# EAGLE design elpc (EAGLE 4.16)
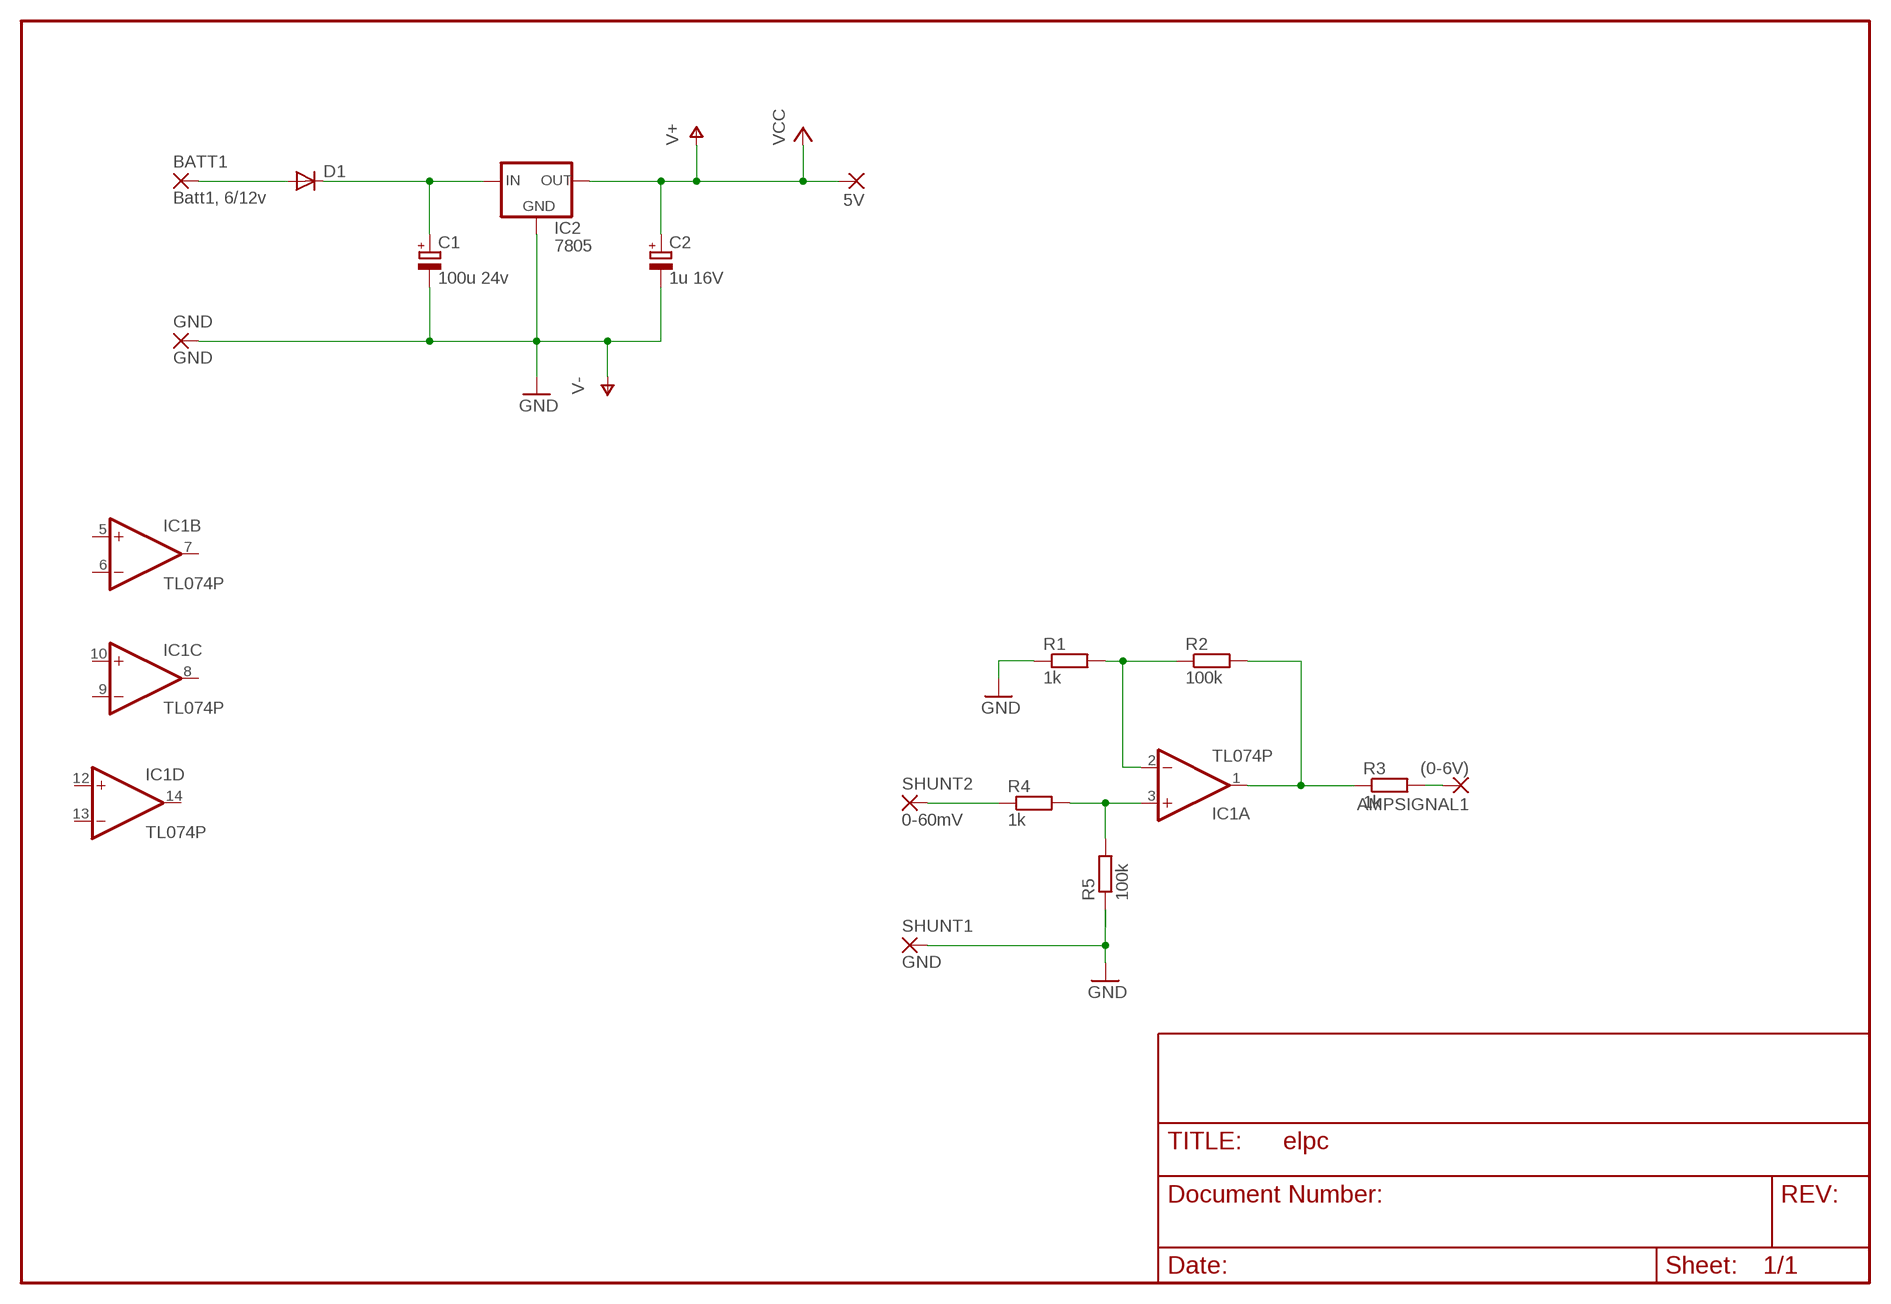
[diagram p0: schematic, sheet 1]

## Parts
5V  3,81/1,4  [3,81/1,4]
AMPSIGNAL1  (0-6V)  3,81/1,4  [3,81/1,4]
BATT1  Batt1, 6/12v  3,81/1,4  [3,81/1,4]
C1  100u 24v  CPOL-EUE2.5-5  [E2,5-5]
C2  1u 16V  CPOL-EUE2.5-5  [E2,5-5]
D1  DIODE-DO35-10  [DO35-10]
GND  GND  3,81/1,4  [3,81/1,4]
IC1  TL074P  [DIL14]
IC2  7805  78XXL  [78XXL]
R1  1k  R-EU_0207/10  [0207/10]
R2  100k  R-EU_0207/10  [0207/10]
R3  1k  R-EU_0207/10  [0207/10]
R4  1k  R-EU_0207/10  [0207/10]
R5  100k  R-EU_0207/10  [0207/10]
SHUNT1  GND  3,81/1,4  [3,81/1,4]
SHUNT2  0-60mV  3,81/1,4  [3,81/1,4]

## Nets
GND: R1.1 R5.1 SHUNT1.1(P)
N$1: IC1.3(A:+IN) R4.2 R5.2
N$2: IC1.2(A:-IN) R1.2 R2.1
N$3: IC1.1(A:OUT) R2.2 R3.1
N$4: BATT1.1(P) D1.A
N$5: C1.+ D1.C IC2.IN
N$6: AMPSIGNAL1.1(P) R3.2
N$7: R4.1 SHUNT2.1(P)
V+: 5V.1(P) C2.+ IC2.OUT ; supply symbol labelled VCC
V-: C1.- C2.- GND.1(P) IC2.GND ; supply symbol labelled GND
Unconnected: IC1.5(B:+IN) IC1.6(B:-IN) IC1.7(B:OUT) IC1.8(C:OUT) IC1.9(C:-IN) IC1.10(C:+IN) IC1.12(D:+IN) IC1.13(D:-IN) IC1.14(D:OUT)

## Power pins joined to a net without a drawn wire
V+: IC1.4(P:V+)
V-: IC1.11(P:V-)

## Library data of the parts
5V AMPSIGNAL1 BATT1 GND SHUNT1 SHUNT2 = wirepad:3,81/1,4: THROUGH-HOLE PAD
C1 C2 = rcl:CPOL-EU: POLARIZED CAPACITOR, European symbol
D1 = diode:DIODE-: DIODE
IC1 = linear:TL074: OP AMP
IC2 = v-reg:78XXL: VOLTAGE REGULATOR
R1-R5 = rcl:R-EU_: RESISTOR, European symbol

## Board
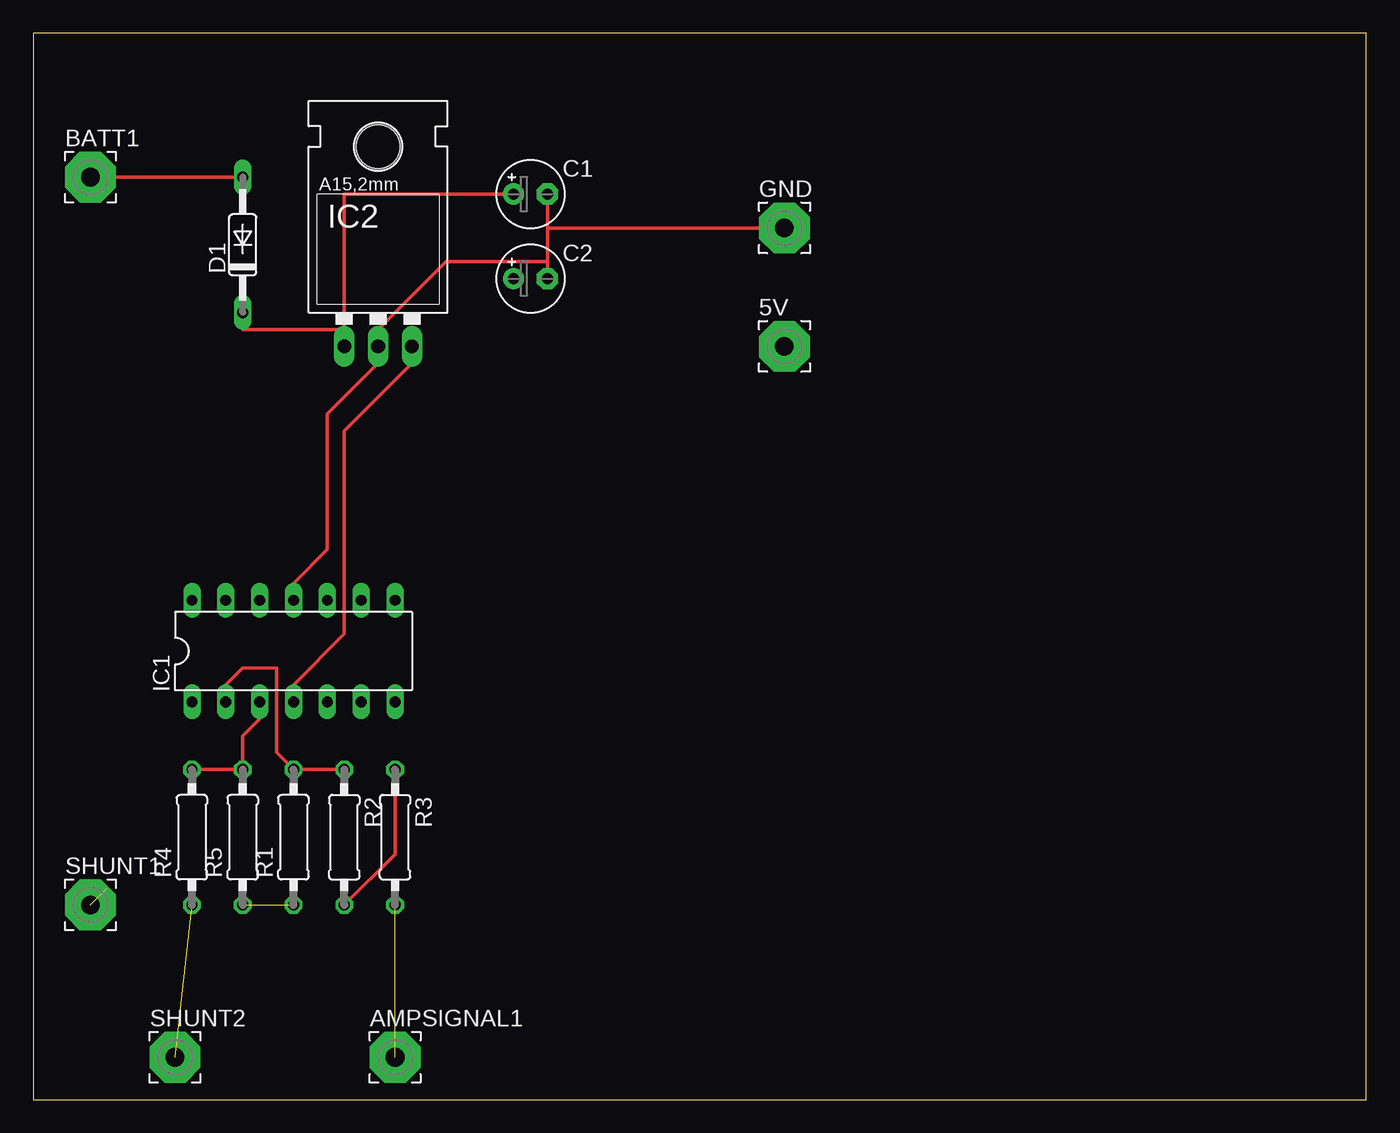
[diagram p1: board, top side]
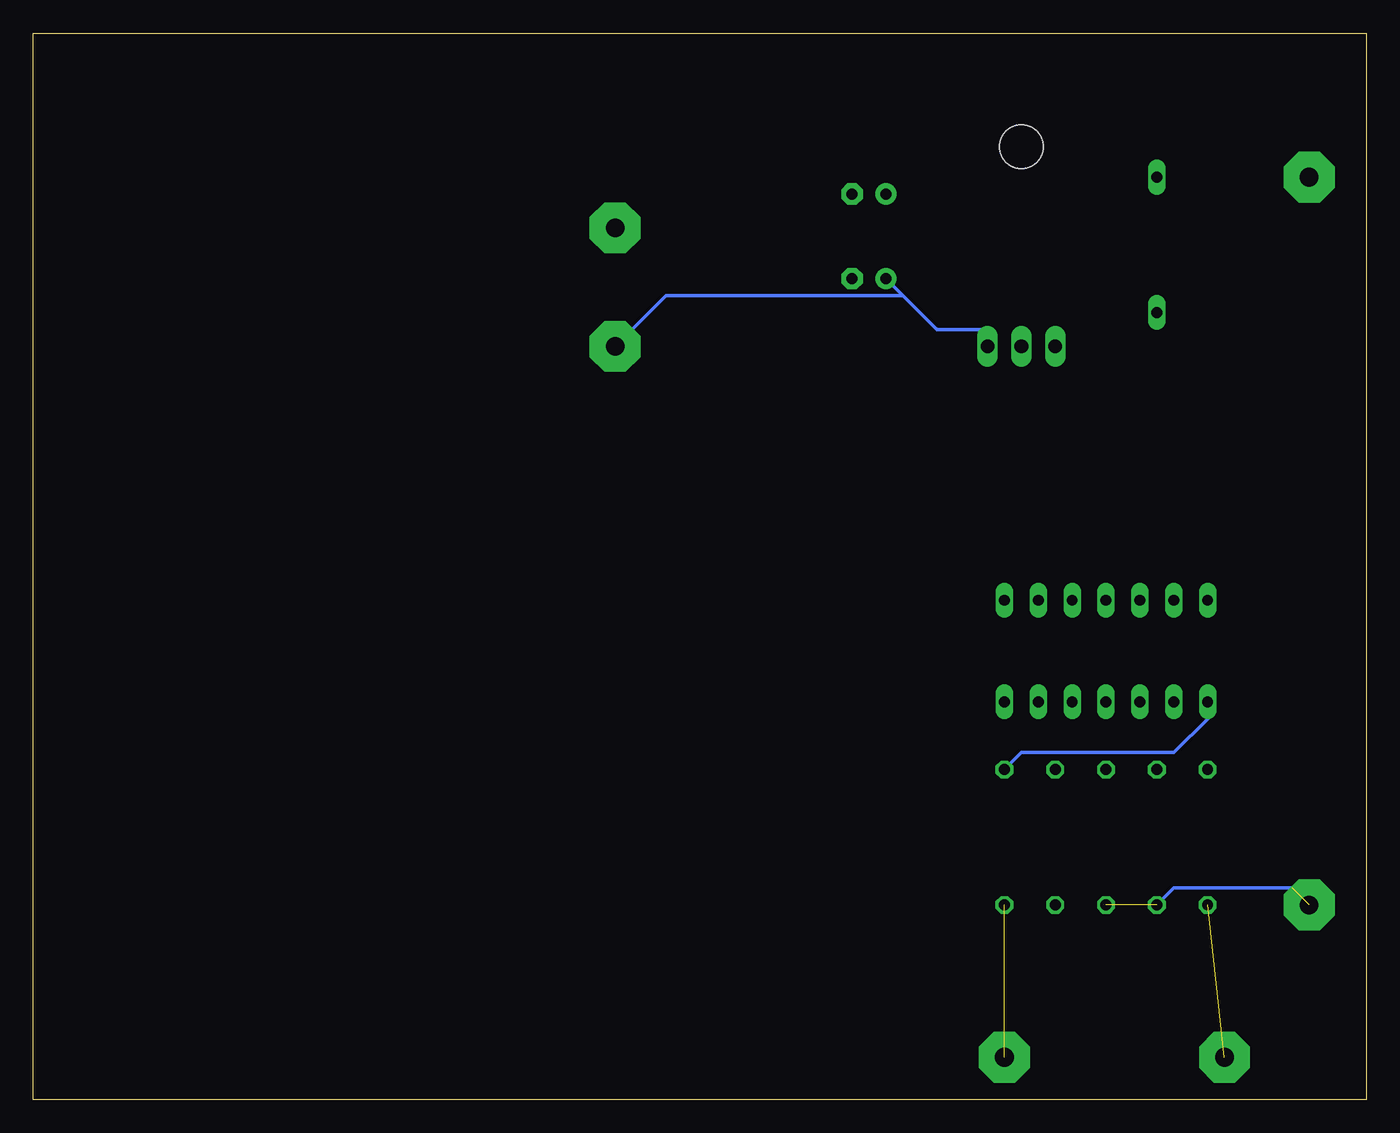
[diagram p2: board, bottom side, seen from below]

Size 100 x 80 mm. Coordinates in mm from the lower left corner, seen from the top.
Outline: 0,0 100,0 100,80 0,80 0,0
Copper layers (1*16): Top 0.035mm / dielectric 1.5mm / Bottom 0.035mm
Design rules "default": minimum track width 10mil, minimum drill 24mil, track to track 8mil, track to pad 8mil, pad to pad 8mil, via to via 8mil, smd to smd 8mil, copper to edge 40mil, drill to drill 8mil, minimum pad ring 10mil, minimum via ring 8mil, stop-mask expansion 4mil, vias tented up to drill 0mil, thermal gap 10mil

### Footprints (pad centres in the part's own frame; a part is rotated, then mirrored left to right if it is on the bottom)
3,81/1,4 = drill 1.397 pad 3.81 octagon: 1 0,0
E2,5-5 = drill 0.813 pad 1.6 round: + -1.27,0 | drill 0.813 pad 1.6 octagon: - 1.27,0
DO35-10 = drill 0.813 long: A 5.08,0; C -5.08,0
DIL14 = drill 0.813 long: 1 -7.62,-3.81; 2 -5.08,-3.81; 3 -2.54,-3.81; 4 0,-3.81; 5 2.54,-3.81; 6 5.08,-3.81; 7 7.62,-3.81; 8 7.62,3.81; 9 5.08,3.81; 10 2.54,3.81; 11 0,3.81; 12 -2.54,3.81; 13 -5.08,3.81; 14 -7.62,3.81
78XXL = drill 1.016 long: GND 0,-3.81; IN -2.54,-3.81; OUT 2.54,-3.81 | hole 3.302: 0,11.176
0207/10 = drill 0.813 octagon: 1 -5.08,0; 2 5.08,0

### Placement (x,y rotation side)
5V  56.35,56.51 0 top
AMPSIGNAL1  27.14,3.17 0 top
BATT1  4.28,69.21 0 top
C1  37.3,67.94 0 top
C2  37.3,61.59 0 top
D1  15.71,64.13 90 top
GND  56.35,65.4 0 top
IC1  19.52,33.65 0 top
IC2  25.87,60.32 0 top
R1  19.52,19.68 90 top
R2  23.33,19.68 270 top
R3  27.14,19.68 270 top
R4  11.9,19.68 90 top
R5  15.71,19.68 90 top
SHUNT1  4.28,14.6 0 top
SHUNT2  10.63,3.17 0 top

### Tracks (layer width: path | path; a pad name or v marks a point on that pad's centre or on a via)
GND  (2 unrouted)
  Bottom 0.254: R5.1 14.44,15.87 5.55,15.87
N$1
  Top 0.254: R4.2 R5.2 15.71,27.3 16.98,28.57 IC1.3
N$2
  Top 0.254: R2.1 R1.2 18.25,26.03 18.25,32.38 15.71,32.38 14.44,31.11 IC1.2
N$3
  Top 0.254: R2.2 27.14,18.41 R3.1
  Bottom 0.254: R3.1 25.87,26.03 14.44,26.03 11.9,28.57 IC1.1
N$4
  Top 0.254: BATT1.1 D1.A
N$5
  Top 0.254: 23.33,57.78 15.71,57.78 D1.C | C1.+ 23.33,67.94 23.33,57.78 | 23.33,57.78 IC2.IN
N$6  (1 unrouted)
N$7  (1 unrouted)
V+
  Top 0.254: IC1.4 19.52,31.11 23.33,34.92 23.33,50.16 28.41,55.24 IC2.OUT
  Bottom 0.254: 34.76,60.32 32.22,57.78 28.41,57.78 IC2.OUT | 34.76,60.32 C2.+ | 34.76,60.32 52.54,60.32 5V.1
V-
  Top 0.254: IC1.11 19.52,38.73 22.06,41.27 22.06,51.43 25.87,55.24 IC2.GND 25.87,57.78 30.95,62.86 38.57,62.86 | 38.57,65.4 C1.- | 38.57,62.86 38.57,65.4 | 38.57,62.86 C2.- | 38.57,65.4 GND.1